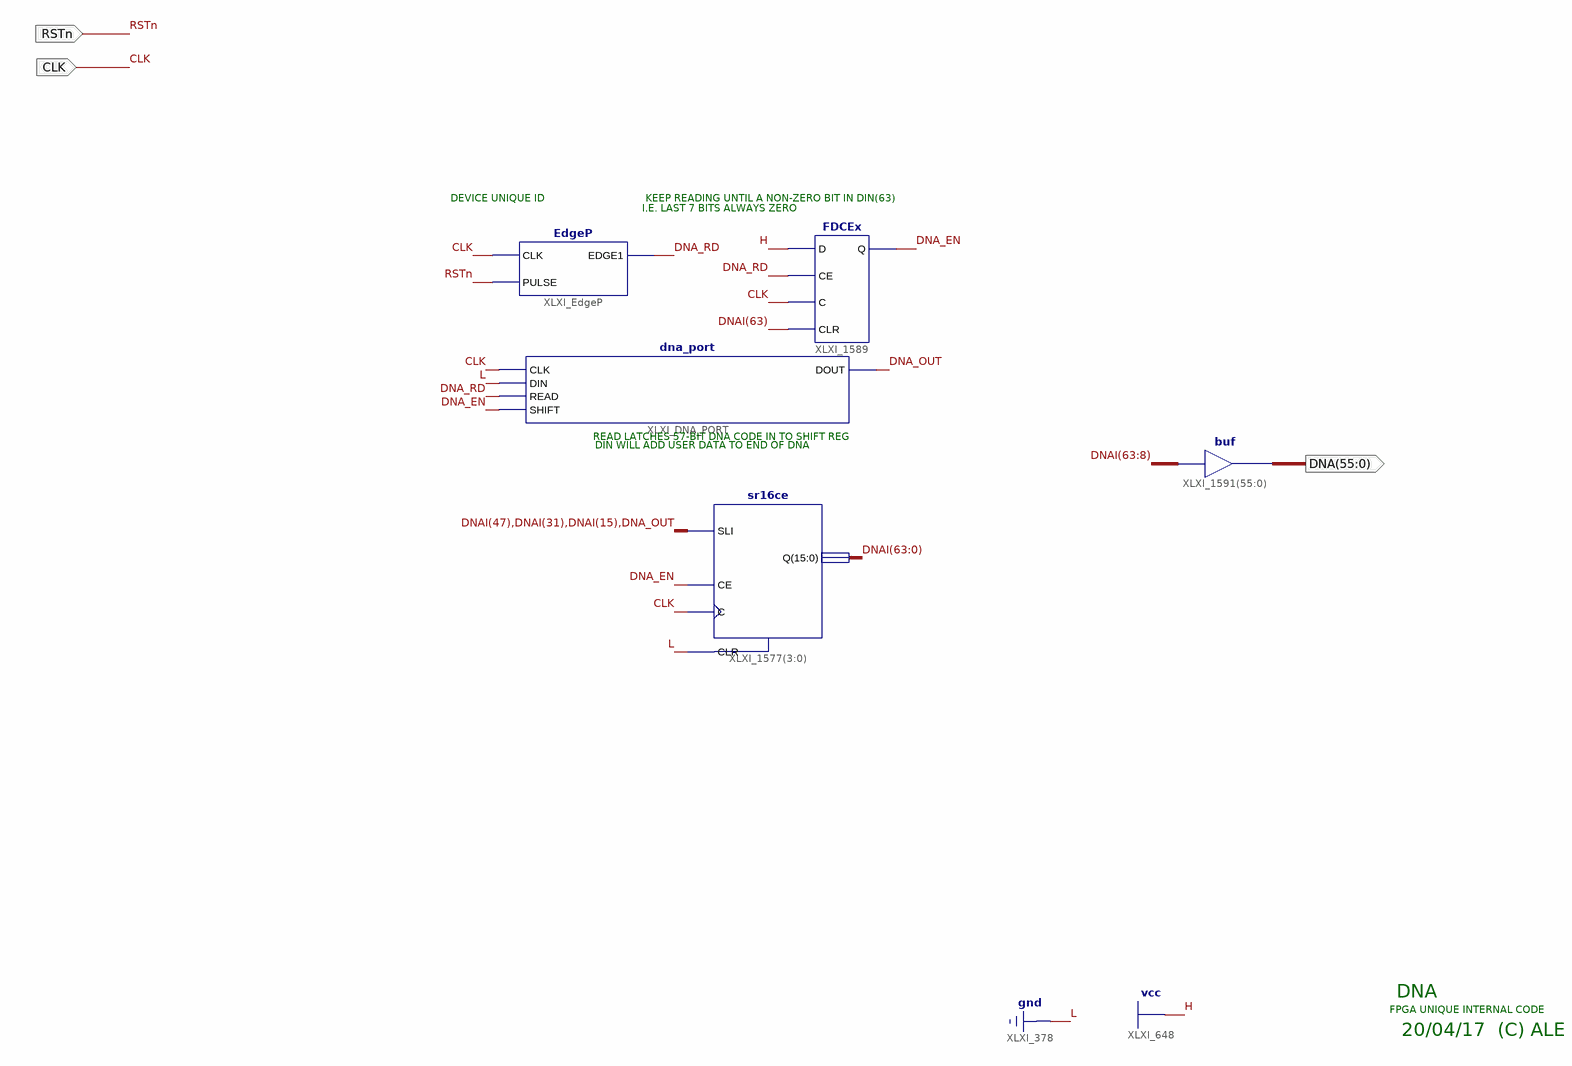
[diagram p0: schematic sheet 1]
// Xilinx ISE schematic DNA.sch (zynq) as structural Verilog: 5 symbols, 3 ports
module DNA (
  input  RSTn,
  input  CLK,
  output [55:0] DNA
);

  wire DNA_EN, DNA_OUT, DNA_RD;
  wire [63:0] DNAI;

  dna_port #(.SIM_DNA_VALUE("800000500000F1")) XLXI_DNA_PORT (
    .CLK(CLK), .DIN(1'b0), .READ(DNA_RD), .SHIFT(DNA_EN), .DOUT(DNA_OUT));
  FDCEx XLXI_1589 (.C(CLK), .CE(DNA_RD), .CLR(DNAI[63]), .D(1'b1), .Q(DNA_EN));
  sr16ce XLXI_1577[3:0] (.C(CLK), .CE(DNA_EN), .CLR(1'b0), .SLI({DNAI[47], DNAI[31], DNAI[15], DNA_OUT}), .Q(DNAI));
  EdgeP XLXI_EdgeP (.CLK(CLK), .EDGE1(DNA_RD), .PULSE(RSTn));
  assign DNA = DNAI[63:8];  // buf XLXI_1591[55..0], 56 bits wide

  // Notes on the sheet:
  //   DEVICE UNIQUE ID
  //   KEEP READING UNTIL A NON-ZERO BIT IN DIN(63)
  //   I.E. LAST 7 BITS ALWAYS ZERO
  //   READ LATCHES 57-BIT DNA CODE IN TO SHIFT REG
  //   DIN WILL ADD USER DATA TO END OF DNA
  //   DNA
  //   FPGA UNIQUE INTERNAL CODE
  //   20/04/17  (C) ALE
endmodule
